# Altium schematic sheet JTAG.SchDoc
size A4
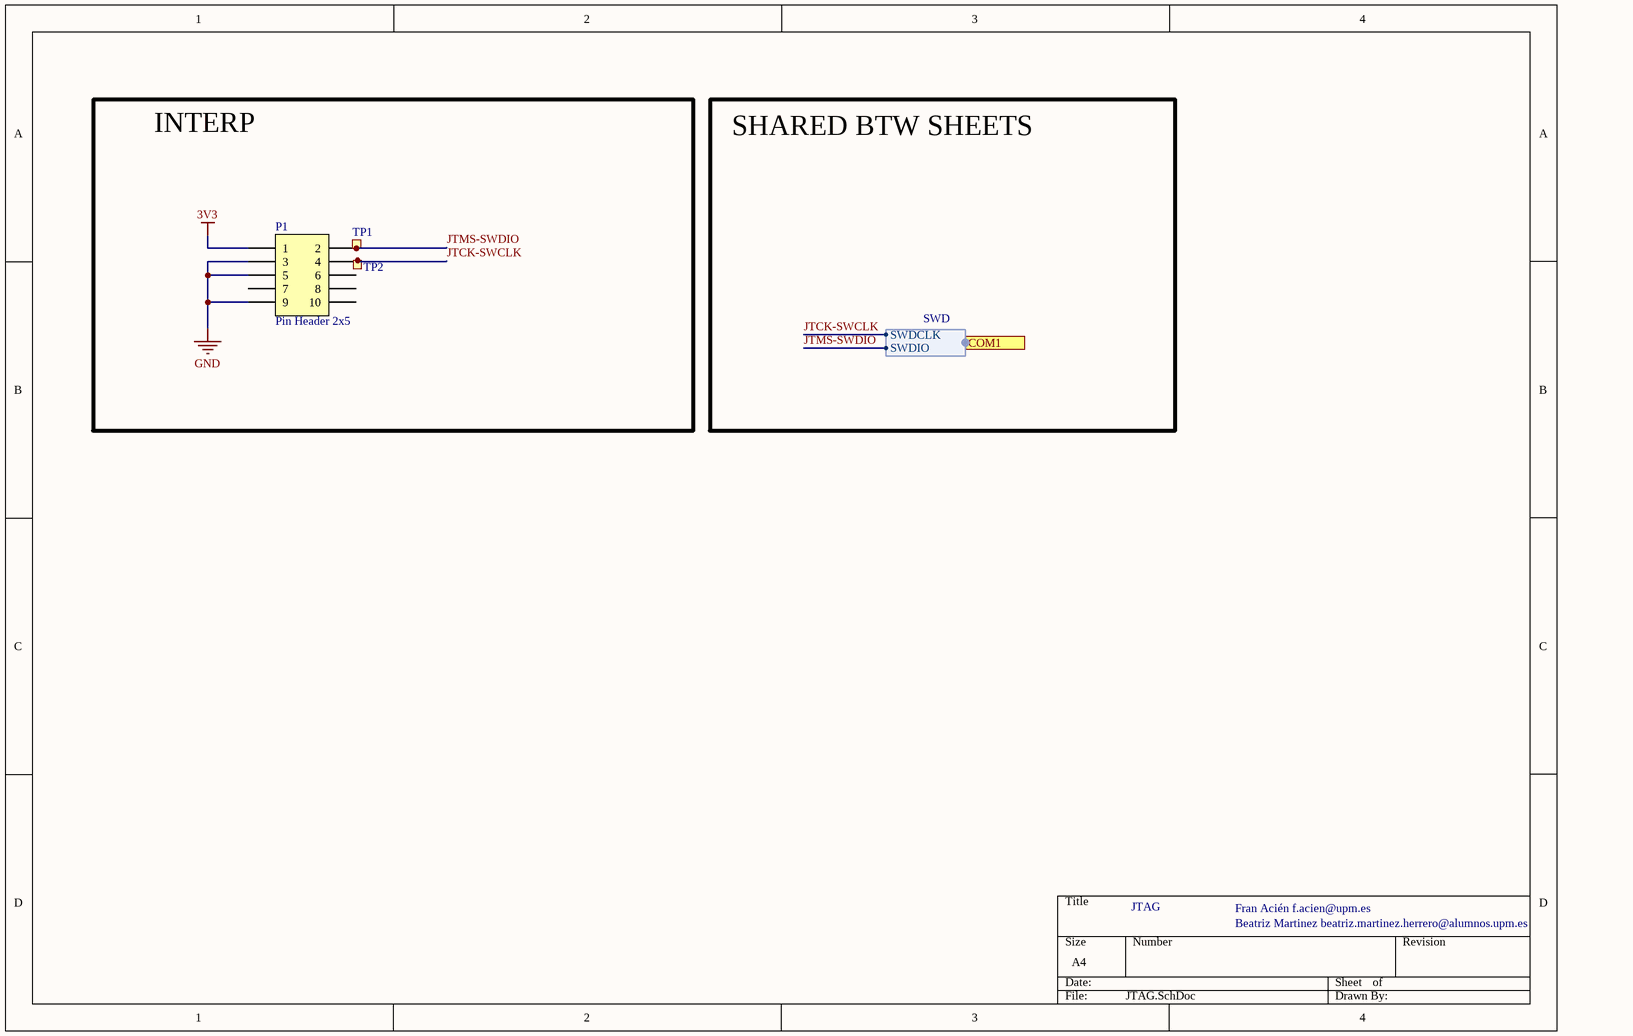
[diagram p0: JTAG.SchDoc]

## Parts
P1  Pin Header 2x5  [HDR_2x5-SMD-1.27mm-ANG]
TP1  Ø1.0mm,SMD  [TP_SMD_Ø1.0mm]  (value not drawn)  (no BOM)
TP2  Ø1.0mm,SMD  [TP_SMD_Ø1.0mm]  (value not drawn)  (no BOM)

## Blocks framed on the sheet
INTERP: P1 TP1 TP2

## Ports
COM1 (harness SWD)

## Harnesses
SWD: SWDCLK, SWDIO

## Nets
3V3: P1.1
GND: P1.3 P1.5 P1.9
JTCK-SWCLK: P1.4 TP2.1 ; port COM1.SWDCLK
JTMS-SWDIO: P1.2 TP1.1 ; port COM1.SWDIO

Not connected (* = marked no-connect by the designer): P1 6 7 8 10

## Notes on the sheet
- SHARED BTW SHEETS
- JTAG
- Fran Acién f.acien@upm.es
- Beatriz Martinez beatriz.martinez.herrero@alumnos.upm.es

## Library data of the parts
P1 = Pin Header 2x5 SMD, 1.27mm, Angled: Pin Header 2x5, 1.27mm (50mil); Manufacturer: Samtec; Manufacturer Part Number: FTSH-105-01-L-DH-A-C-TR; Part number IPS: 00000007800; Artikkelnr Noca: N.A.; Part Number: Pin Header 2x5 SMD, 1.27mm, Angled; LatestRevisionDate: 2014-01-22; Pin Count: 10; Publisher: Nordic Semiconductor; Published: 2014-01-22; Value: Pin Header 2x5; Note: *; Footprint Doc: HDR_2x5-SMD-1.27mm-ANG; ComponentLink1URL: *; ComponentLink1Description: Datasheet; ComponentLink2URL: *; ComponentLink2Description: Supplier link; HelpURL: http://www.samtec.com/documents/webfiles/pdf/FTSH_SMT.PDF; Supplier 1: Samtec; Supplier Part Number 1: FTSH-105-01-L-DH-A-C-TR; Supplier 2: *; Supplier Part Number 2: *
TP1 TP2 = TP_SMD_Ø1.0MM: 1.0mm circular SMD testpad; Manufacturer: Nordic Semiconductor; Artikkelnr Noca: N.A.; Part Number: TP_SMD_Ø1.0MM; Manufacturer Part Number: *; ComponentLink1URL: *; ComponentLink1Description: Datasheet; ComponentLink2URL: *; ComponentLink2Description: Supplier link; HelpURL: *; Footprint Doc: TP_SMD_Ø1.0mm; LatestRevisionDate: 2013-06-11; Pin Count: 1; Publisher: Nordic Semiconductor; Published: 2013-06-11; Value: Ø1.0mm,SMD; Note: *; Supplier 1: *; Supplier Part Number 1: *; Supplier 2: *; Supplier Part Number 2: *; Part number IPS: N.A.